# Altium project EEF AFE Base Board.PrjPcb
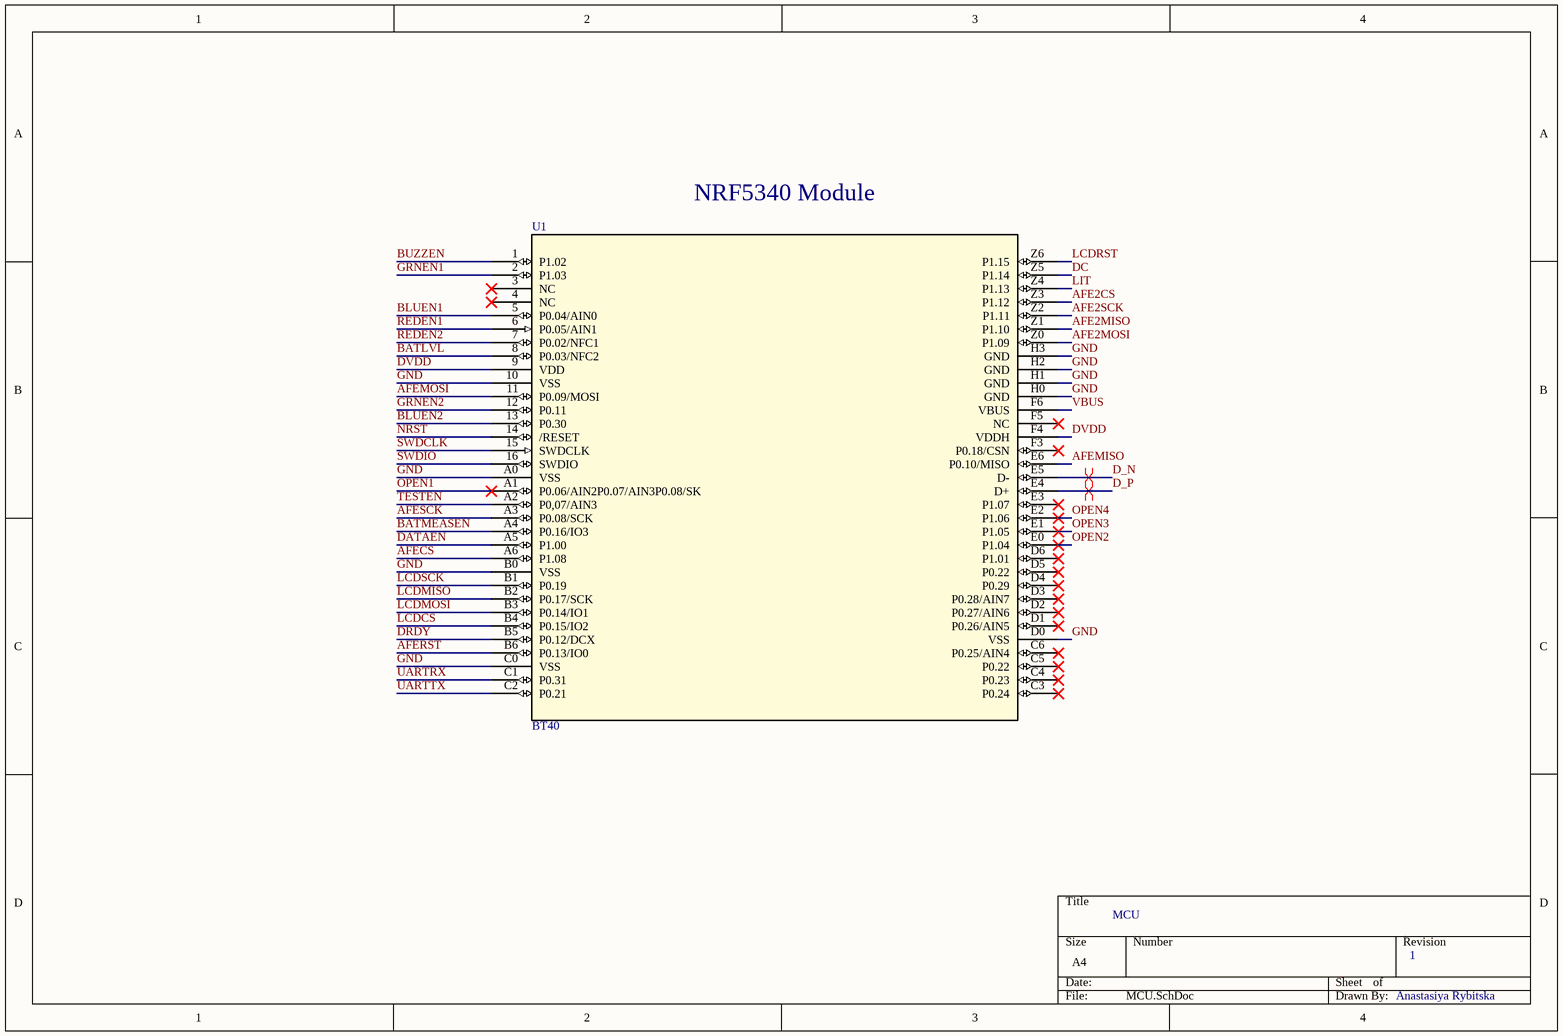
[diagram p0: MCU.SchDoc]
5 sheets, 114 parts. Net scope: global (net labels, ports and power ports of the same name join across sheets).
Board file: PCB1.PcbDoc
Sheets:
  MCU.SchDoc
  Power.SchDoc
  AFE.SchDoc
  EEG Inputs.SchDoc
  Peripherals.SchDoc

## Sheet MCU.SchDoc
size A4; SheetNumber: 1; SheetTotal: 5

### Parts
U1  BT40  [BT40E_FAN_FNL]

### Nets
DVDD: U1.9(VDD) U1.F4(VDDH)
GND: U1.10(VSS) U1.A0(VSS) U1.B0(VSS) U1.C0(VSS) U1.D0(VSS) U1.H0(GND) U1.H1(GND) U1.H2(GND) U1.H3(GND)
AFE2CS: U1.Z3(P1.12)
AFE2MISO: U1.Z1(P1.10)
AFE2MOSI: U1.Z0(P1.09)
AFE2SCK: U1.Z2(P1.11)
AFECS: U1.A6(P1.08)
AFEMISO: U1.E6(P0.10/MISO)
AFEMOSI: U1.11(P0.09/MOSI)
AFERST: U1.B6(P0.13/IO0)
AFESCK: U1.A3(P0.08/SCK)
BATLVL: U1.8(P0.03/NFC2)
BATMEASEN: U1.A4(P0.16/IO3)
BLUEN1: U1.5(P0.04/AIN0)
BLUEN2: U1.13(P0.30)
BUZZEN: U1.1(P1.02)
D_N: U1.E5(D-)
D_P: U1.E4(D+)
DATAEN: U1.A5(P1.00)
DC: U1.Z5(P1.14)
DRDY: U1.B5(P0.12/DCX)
GRNEN1: U1.2(P1.03)
GRNEN2: U1.12(P0.11)
LCDCS: U1.B4(P0.15/IO2)
LCDMISO: U1.B2(P0.17/SCK)
LCDMOSI: U1.B3(P0.14/IO1)
LCDRST: U1.Z6(P1.15)
LCDSCK: U1.B1(P0.19)
LIT: U1.Z4(P1.13)
NRST: U1.14(/RESET)
OPEN1: U1.A1(P0.06/AIN2P0.07/AIN3P0.08/SK)
OPEN2: U1.E0(P1.04)
OPEN3: U1.E1(P1.05)
OPEN4: U1.E2(P1.06)
REDEN1: U1.6(P0.05/AIN1)
REDEN2: U1.7(P0.02/NFC1)
SWDCLK: U1.15(SWDCLK)
SWDIO: U1.16(SWDIO)
TESTEN: U1.A2(P0,07/AIN3)
UARTRX: U1.C1(P0.31)
UARTTX: U1.C2(P0.21)
VBUS: U1.F6(VBUS)

Not connected (* = marked no-connect by the designer): U1 3(NC)* 4(NC)* C3(P0.24)* C4(P0.23)* C5(P0.22)* C6(P0.25/AIN4)* D1(P0.26/AIN5)* D2(P0.27/AIN6)* D3(P0.28/AIN7)* D4(P0.29)* D5(P0.22)* D6(P1.01)* E3(P1.07)* F3(P0.18/CSN)* F5(NC)*

### Layout directives
differential pair: D_N, D_P

### Notes on the sheet
- NRF5340 Module
- MCU
- 1
- Anastasiya Rybitska

### Library data of the parts
U1 = BT40: No Description Available; Mfr_Name: Fanstel; Type: RF; Copyright: Copyright (C) 2023 Ultra Librarian. All rights reserved.; Manufacturer_Part_Number: BT40; RefDes: RefDes

## Sheet Power.SchDoc
size A4; SheetNumber: 2; SheetTotal: 5
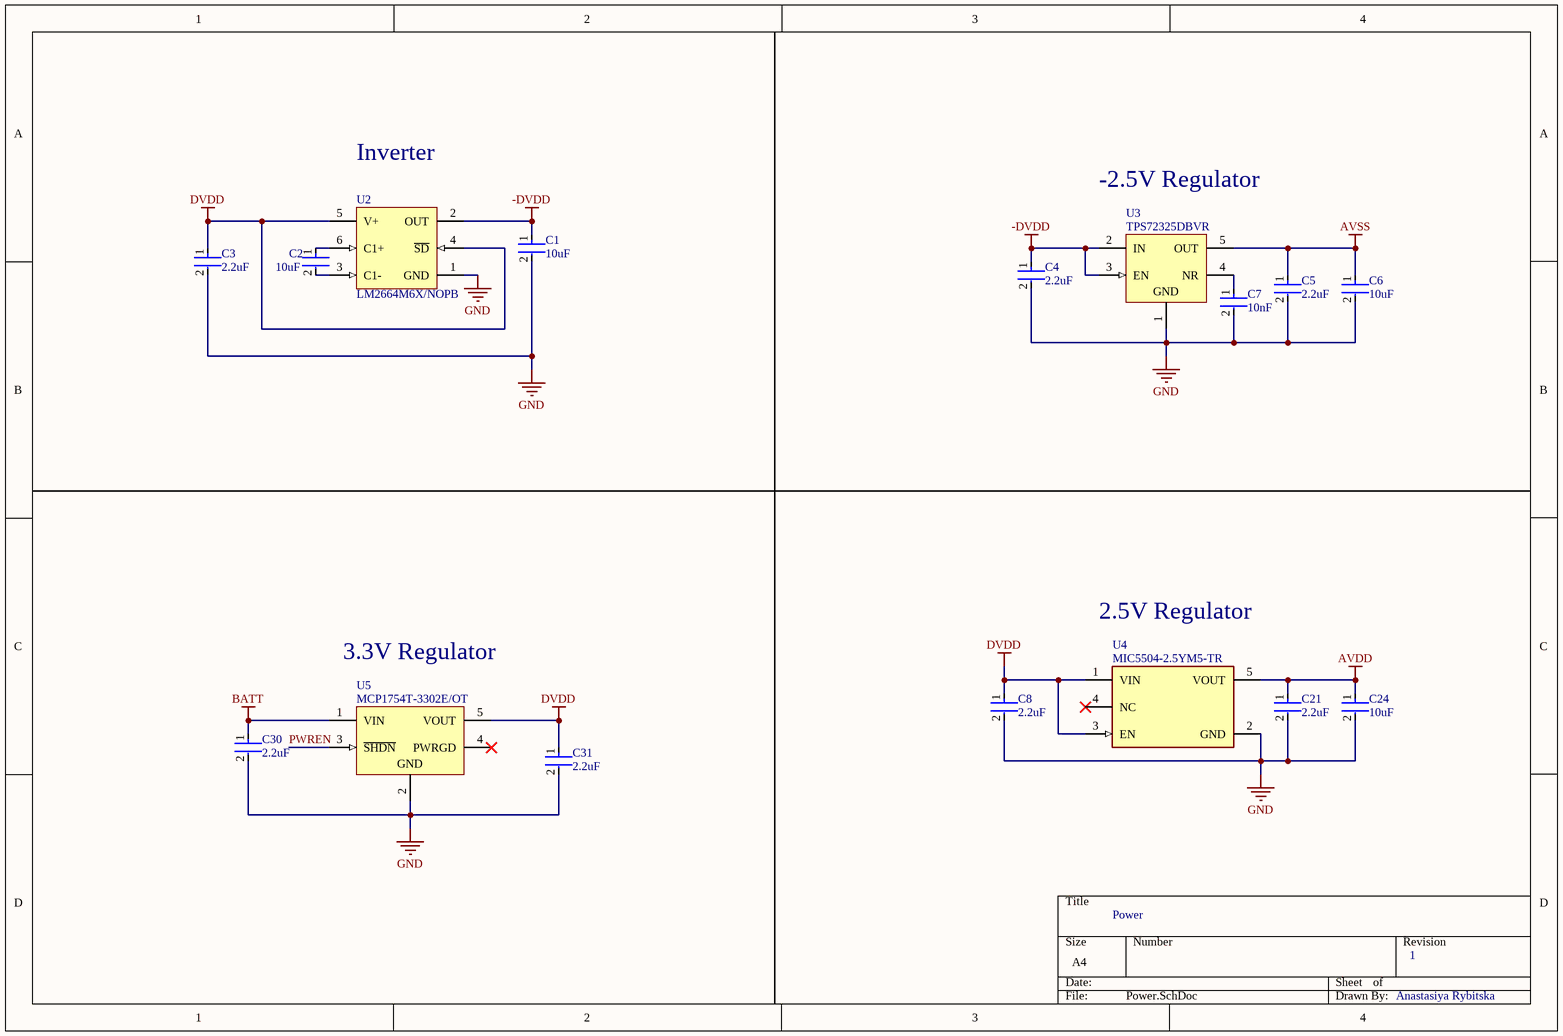
[diagram p1: Power.SchDoc]

### Parts
C1  Capacitance: 10uF  [FP-CL10-IPC_C]  (hidden comment: CL10A106MQ8NNNC)
C2  Capacitance: 10uF  [FP-CL10-IPC_C]  (hidden comment: CL10A106MQ8NNNC)
C3  Capacitance: 2.2uF  [FP-CL10-IPC_A]  (hidden comment: CL10A225KO8NNNC)
C4  Capacitance: 2.2uF  [FP-CL10-IPC_A]  (hidden comment: CL10A225KO8NNNC)
C5  Capacitance: 2.2uF  [FP-CL10-IPC_A]  (hidden comment: CL10A225KO8NNNC)
C6  Capacitance: 10uF  [FP-CL10-IPC_C]  (hidden comment: CL10A106MQ8NNNC)
C7  value 10nF  [FP-CC0603-DA-MFG]  (hidden comment: CC0603KRX7R9BB103)
C8  Capacitance: 2.2uF  [FP-CL10-IPC_A]  (hidden comment: CL10A225KO8NNNC)
C21  Capacitance: 2.2uF  [FP-CL10-IPC_A]  (hidden comment: CL10A225KO8NNNC)
C24  Capacitance: 10uF  [FP-CL10-IPC_C]  (hidden comment: CL10A106MQ8NNNC)
C30  Capacitance: 2.2uF  [FP-CL10-IPC_A]  (hidden comment: CL10A225KO8NNNC)
C31  Capacitance: 2.2uF  [FP-CL10-IPC_A]  (hidden comment: CL10A225KO8NNNC)
U2  LM2664M6X/NOPB  [DBV0006A_M]
U3  TPS72325DBVR  [DBV0005A_N]
U4  MIC5504-2.5YM5-TR  [FP-SOT23-5LD-PL-1-IPC_C]
U5  MCP1754T-3302E/OT  [MCHP-SOT-23-OT5_L]

### Nets
-DVDD: C1.1 C4.1 U2.2(OUT) U3.2(IN) U3.3(EN)
AVDD: C21.1 C24.1 U4.5(VOUT)
AVSS: C5.1 C6.1 U3.5(OUT)
BATT: C30.1 U5.1(VIN)
DVDD: C3.1 C8.1 C31.1 U2.4(~{SD}) U2.5(V+) U4.1(VIN) U4.3(EN) U5.5(VOUT)
GND: C1.2 C3.2 C4.2 C5.2 C6.2 C7.2 C8.2 C21.2 C24.2 C30.2 C31.2 U2.1(GND) U3.1(GND) U4.2(GND) U5.2(GND)
PWREN: U5.3(~{SHDN})
NetC2_1: C2.1 U2.6(C1+)
NetC2_2: C2.2 U2.3(C1-)
NetC7_1: C7.1 U3.4(NR)

Not connected (* = marked no-connect by the designer): U4 4(NC)*; U5 4(PWRGD)*

### Notes on the sheet
- Inverter
- -2.5V Regulator
- 2.5V Regulator
- 3.3V Regulator
- Power
- 1
- Anastasiya Rybitska

### Library data of the parts
C1 C2 C6 C24 = CMP-13271-001938-1: Cap Ceramic 10uF 6.3V X5R ±20% Pad SMD 0603 +85°C T/R; Contact Plating: Tin; Height: 0.8mm; Width: 0.031inch; Min Operating Temperature: -55°C; Dielectric: X5R; Voltage Rating: 6.3V; Case/Package: 0603; Package Quantity: 1; Radiation Hardening: No; Packaging: Tape and Reel; Max Operating Temperature: 85°C; Voltage: 6.3V; Thickness: 0.035inch; Mount: Surface Mount; Case Code (Imperial): 0603; Case Code (Metric): 1608; Depth: 0.8mm; Tolerance: 20%; Length: 1.6mm
C3-C5 C8 C21 C30 C31 = CMP-13271-000835-1: Cap Ceramic 2.2uF 16V X5R ±10% Pad SMD 0603 +85°C T/R; Case Code (Metric): 1608; Height: 0.8mm; Case/Package: 0603; Depth: 0.8mm; Voltage Rating: 16V; Case Code (Imperial): 0603; Length: 1.6mm; Packaging: Tape and Reel; Material: Ceramic; Lead Free: Lead Free; Max Operating Temperature: 85°C; Contact Plating: Tin; Thickness: 0.035inch; Radiation Hardening: No; Tolerance: 10%; Min Operating Temperature: -55°C; Voltage: 16V; Dielectric: X5R; Mount: Surface Mount; Package Quantity: 4000; Width: 0.031inch; Voltage Rating (DC): 16V
C7 = CMP-2100-03600-2: CAP CER 10000PF 50V X7R 0603; Manufacturer: YAGEO; Tolerance: 0.1; Material: Ceramic; Temperature Coefficient: 15%; Description: CC0603 10 nF X7R 10.00% 50 V; Capacitance: 10 nF; Mouser Description: Multilayer Ceramic Capacitor, CC Series, 0.01 - F, - 10%, X7R, 50 V, 0603 [1608 Metric]; Digikey Description: CAP CER 10000PF 50V X7R 0603; Height: 0.9mm; Category: Cap; Temperature Characteristic: X7R; Footprint Url: http://www.yageo.com/exep/pages/download/literatures/UPY-C_GEN_24.pdf; Lead Free: Yes; Voltage Rating: 50 V; Manufacturer Part Number: CC0603KRX7R9BB103; Temperature: -55°C to +125°C; Device Class L3: Ceramic Capacitors; ComponentLink2Description: Datasheet; Voltage: 50 V; Package: CC0603-DA; Octopart: https://octopart.com/cc0603krx7r9bb103-yageo-192938; Automotive: No; Temperature Range High: +125°C; Temperature Range Low: -55°C; RoHS: TRUE; Device Class L1: Passive Components; ComponentLink2URL: http://www.yageo.com/documents/recent/UPY-GPHC_X7R_6.3V-to-50V_18.pdf; Device Class L2: Capacitors
U2 = CMP-0065-00076-3: Switched Capacitor Voltage Converter, 6-pin SOT-23, Pb-Free; Manufacturer: Texas Instruments; CompType: Switch Caps; PackageTopMarking: S03A*XTT; PowerWise: N; PackageDescription: Molded SOT-23, .115 x .063 x .040in Body, 6 Lead, .0375in in Pitch; PinCount: 6; RoHS: Y; PackageReference: DBV0006A; ComponentLink1Description: Datasheet URL; Code_JEDEC: MO-178-AB; Code_IPC: SOT26A-6; ComponentLink1URL: http://www.ti.com/general/docs/lit/getliterature.tsp?genericPartNumber=LM2664&fileType=pdf
U3 = CMP-0394-00292-2: Single Output High PSRR LDO, 200 mA, Fixed -2.5 V Output, -10 to -2.7 V Input, 5-pin SOT-23 (DBV), -40 to 125 degC, Green (RoHS & no Sb/Br); Manufacturer: Texas Instruments; Iout(Max)(A): 0.2; Iq(Typ)(mA): 0.13; Accuracy(%): 2; Vdo(Typ)(mV): 280; SubFamily: Single Channel LDO; Vin(Max)(V): -2.7; PartNumber: TPS72325DBVR; PackageReference: DBV0005A; ComponentLink3Description: Package Specification; Fixed Output Options(V): -2.5; ComponentLink1URL: http://www.ti.com/; ComponentLink1Description: Manufacturer URL; Mounting Technology: Surface Mount; PackageDescription: 5-Pin Plastic Small Outline, Body 1.60 Ãƒâ€” 2.90 mm, Pitch 0.95 mm; ComponentLink2URL: http://www.ti.com/general/docs/lit/getliterature.tsp?genericPartNumber=TPS72325&fileType=pdf; PackageVersion: 4073253-4/K; ComponentLink3URL: http://www.ti.com/litv/pdf/mpds018i; Vout Adj(Min)(V): -2.5; ComponentLink2Description: Datasheet; Vout Adj(Max)(V): -2.5; Eco-Plan: Green (RoHS & no Sb/Br); DatasheetVersion: SLVS346B; Vin(Min)(V): -10; Code_JEDEC: MO-178
U4 = CMP-06324-000081-1: IC REG LINEAR 2.5V 300MA SOT23-5; Dropout Voltage: 160mV; Number of Regulators: 1; Min Current Limit: 400mA; Mount: Surface Mount; Output Current: 300mA; Min Operating Temperature: -40°C; Case/Package: SOT-23-5; Output Voltage: 2.5V; Packaging: Cut Tape; Max Operating Temperature: 125°C
U5 = CMP-0136-01150-1: 150 mA, 16 V, High Performance LDO, -40 to 125 degC, 5-pin SOT-23 (OT5), Tape and Reel; Manufacturer: Microchip; DatasheetVersion: Rev. A; ComponentLink3Description: Package Specification; ComponentLink4Description: Product URL; ComponentLink1URL: http://www.microchip.com; PackageReference: SOT-23-OT5; ComponentLink4URL: http://www.microchip.com/MCP1754; ComponentLink3URL: http://www.microchip.com/stellent/groups/techpub_sg/documents/packagingspec/en012702.pdf; ComponentLink1Description: Manufacturer URL; ComponentLink2URL: http://ww1.microchip.com/downloads/en/DeviceDoc/22276A.pdf; PackageDescription: 5-Lead Plastic Small Outline Transistor, 2.9 x 1.55 mm Body, 0.95 mm Pitch; PackageVersion: C04-091B; PartNumber: MCP1754T-3302E/OT; Mounting Technology: Surface Mount; ComponentLink2Description: Datasheet

## Sheet AFE.SchDoc
size A4; SheetNumber: 3; SheetTotal: 5
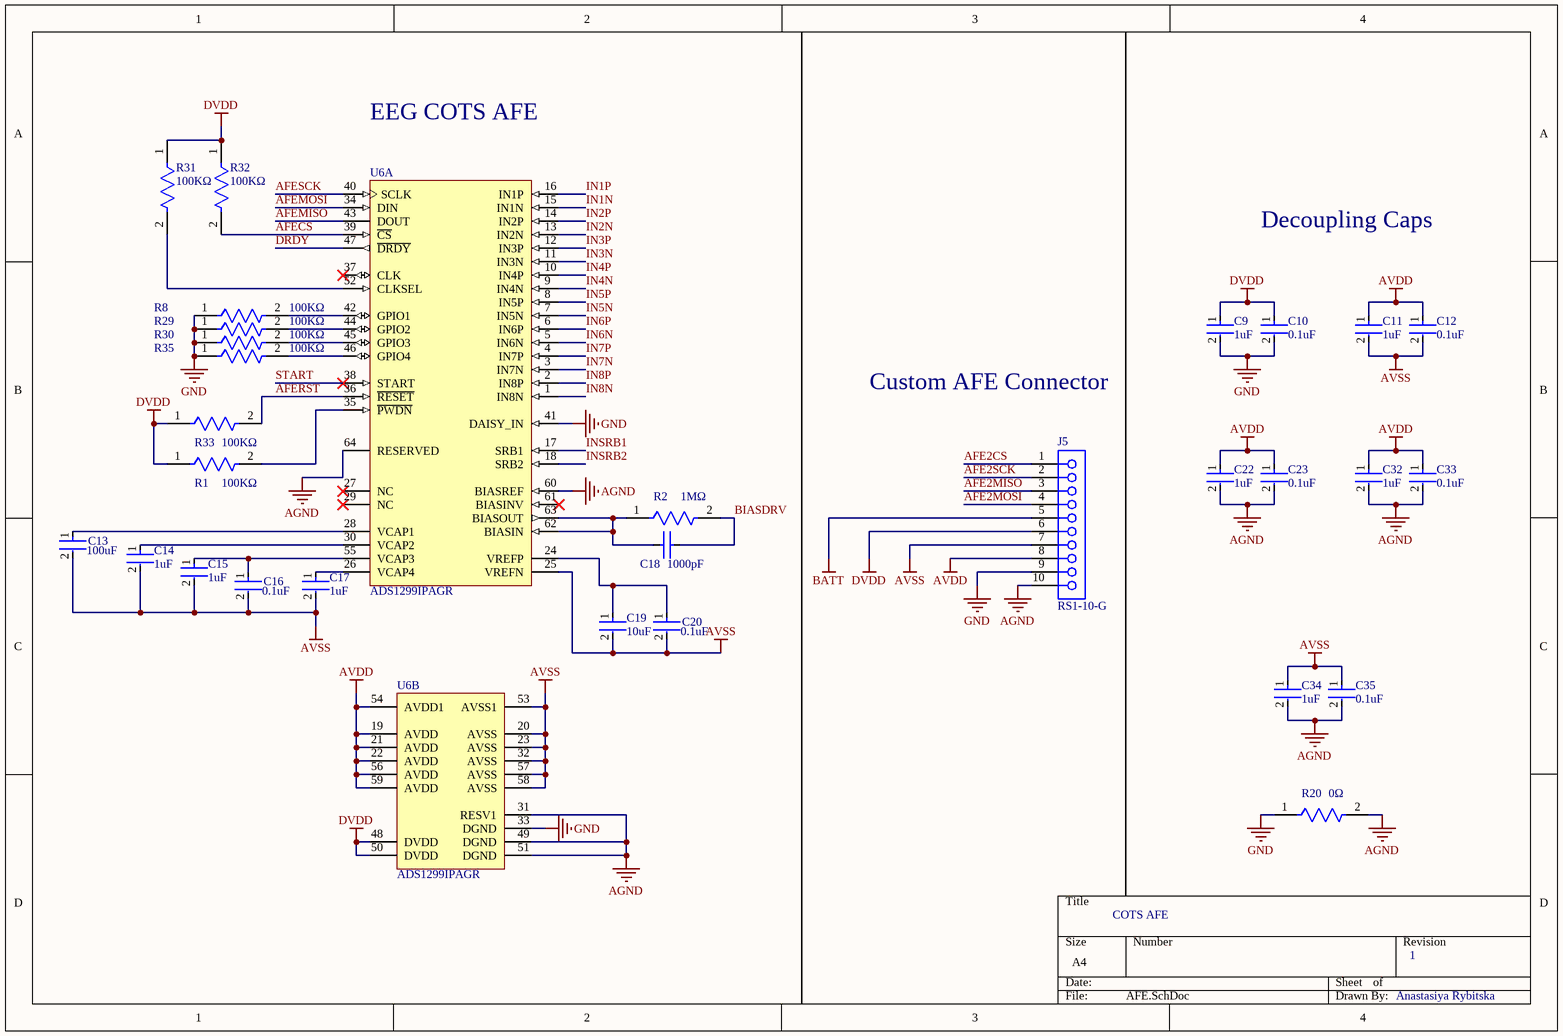
[diagram p2: AFE.SchDoc]

### Parts
C9  Capacitance: 1uF  [FP-CL10-IPC_C]  (hidden comment: CL10A105KA8NNNC)
C10  Capacitance: 0.1uF  [FP-0603-L_1_6_0_15-W_0_81-MFG]  (hidden comment: KGM15BR71H104JT)
C11  Capacitance: 1uF  [FP-CL10-IPC_C]  (hidden comment: CL10A105KA8NNNC)
C12  Capacitance: 0.1uF  [FP-0603-L_1_6_0_15-W_0_81-MFG]  (hidden comment: KGM15BR71H104JT)
C13  Capacitance: 100uF  [FP-GRM21B-0_2-e0_2_0_7-IPC_A]  (hidden comment: GRM21BR60E107ME15K)
C14  Capacitance: 1uF  [FP-CL10-IPC_C]  (hidden comment: CL10A105KA8NNNC)
C15  Capacitance: 1uF  [FP-CL10-IPC_C]  (hidden comment: CL10A105KA8NNNC)
C16  Capacitance: 0.1uF  [FP-0603-L_1_6_0_15-W_0_81-MFG]  (hidden comment: KGM15BR71H104JT)
C17  Capacitance: 1uF  [FP-CL10-IPC_C]  (hidden comment: CL10A105KA8NNNC)
C18  Capacitance: 1000pF  [CAP_0603_S_WAL]  (hidden comment: 0603N102F500CT)
C19  Capacitance: 10uF  [FP-CL10-IPC_C]  (hidden comment: CL10A106MQ8NNNC)
C20  Capacitance: 0.1uF  [FP-0603-L_1_6_0_15-W_0_81-MFG]  (hidden comment: KGM15BR71H104JT)
C22  Capacitance: 1uF  [FP-CL10-IPC_C]  (hidden comment: CL10A105KA8NNNC)
C23  Capacitance: 0.1uF  [FP-0603-L_1_6_0_15-W_0_81-MFG]  (hidden comment: KGM15BR71H104JT)
C32  Capacitance: 1uF  [FP-CL10-IPC_C]  (hidden comment: CL10A105KA8NNNC)
C33  Capacitance: 0.1uF  [FP-0603-L_1_6_0_15-W_0_81-MFG]  (hidden comment: KGM15BR71H104JT)
C34  Capacitance: 1uF  [FP-CL10-IPC_C]  (hidden comment: CL10A105KA8NNNC)
C35  Capacitance: 0.1uF  [FP-0603-L_1_6_0_15-W_0_81-MFG]  (hidden comment: KGM15BR71H104JT)
J5  RS1-10-G  [61301011821]
R1  Resistance: 100KΩ  [FP-RMCF0603-IPC_C]  (hidden comment: RMCF0603FT100K)
R2  Resistance: 1MΩ  [FP-ERJ3EK-IPC_C]  (hidden comment: ERJ-3EKF1004V)
R8  Resistance: 100KΩ  [FP-RMCF0603-IPC_C]  (hidden comment: RMCF0603FT100K)
R20  Resistance: 0Ω  [FP-RMCF0603-MFG]  (hidden comment: RMCF0603ZT0R00)
R29  Resistance: 100KΩ  [FP-RMCF0603-IPC_C]  (hidden comment: RMCF0603FT100K)
R30  Resistance: 100KΩ  [FP-RMCF0603-IPC_C]  (hidden comment: RMCF0603FT100K)
R31  Resistance: 100KΩ  [FP-RMCF0603-IPC_C]  (hidden comment: RMCF0603FT100K)
R32  Resistance: 100KΩ  [FP-RMCF0603-IPC_C]  (hidden comment: RMCF0603FT100K)
R33  Resistance: 100KΩ  [FP-RMCF0603-IPC_C]  (hidden comment: RMCF0603FT100K)
R35  Resistance: 100KΩ  [FP-RMCF0603-IPC_C]  (hidden comment: RMCF0603FT100K)
U6  ADS1299IPAGR  [PAG0064A_M]  (parts A,B of 2)

### Nets
AGND: C22.2 C23.2 C32.2 C33.2 C34.2 C35.2 J5.10 R20.2 U6.31(RESV1) U6.49(DGND) U6.51(DGND) U6.60(BIASREF) U6.64(RESERVED)
AVDD: C11.1 C12.1 C22.1 C23.1 C32.1 C33.1 J5.8 U6.19(AVDD) U6.21(AVDD) U6.22(AVDD) U6.54(AVDD1) U6.56(AVDD) U6.59(AVDD)
AVSS: C11.2 C12.2 C13.2 C14.2 C15.2 C16.2 C17.2 C19.2 C20.2 C34.1 C35.1 J5.7 U6.20(AVSS) U6.23(AVSS) U6.25(VREFN) U6.32(AVSS) U6.53(AVSS1) U6.57(AVSS) U6.58(AVSS)
BATT: J5.5
DVDD: C9.1 C10.1 J5.6 R1.1 R31.1 R32.1 R33.1 U6.48(DVDD) U6.50(DVDD)
GND: C9.2 C10.2 J5.9 R8.1 R20.1 R29.1 R30.1 R35.1 U6.33(DGND) U6.41(DAISY_IN)
AFE2CS: J5.1
AFE2MISO: J5.3
AFE2MOSI: J5.4
AFE2SCK: J5.2
AFECS: R32.2 U6.39(~{CS})
AFEMISO: U6.43(DOUT)
AFEMOSI: U6.34(DIN)
AFERST: R33.2 U6.36(~{RESET})
AFESCK: U6.40(SCLK)
BIASDRV: C18.2 R2.2
DRDY: U6.47(~{DRDY})
IN1N: U6.15(IN1N)
IN1P: U6.16(IN1P)
IN2N: U6.13(IN2N)
IN2P: U6.14(IN2P)
IN3N: U6.11(IN3N)
IN3P: U6.12(IN3P)
IN4N: U6.9(IN4N)
IN4P: U6.10(IN4P)
IN5N: U6.7(IN5N)
IN5P: U6.8(IN5P)
IN6N: U6.5(IN6N)
IN6P: U6.6(IN6P)
IN7N: U6.3(IN7N)
IN7P: U6.4(IN7P)
IN8N: U6.1(IN8N)
IN8P: U6.2(IN8P)
INSRB1: U6.17(SRB1)
INSRB2: U6.18(SRB2)
START: U6.38(START)
NetC13_1: C13.1 U6.28(VCAP1)
NetC14_1: C14.1 U6.30(VCAP2)
NetC15_1: C15.1 C16.1 U6.55(VCAP3)
NetC17_1: C17.1 U6.26(VCAP4)
NetC18_1: C18.1 R2.1 U6.62(BIASIN) U6.63(BIASOUT)
NetC19_1: C19.1 C20.1 U6.24(VREFP)
NetR1_2: R1.2 U6.35(~{PWDN})
NetR8_2: R8.2 U6.42(GPIO1)
NetR29_2: R29.2 U6.44(GPIO2)
NetR30_2: R30.2 U6.45(GPIO3)
NetR31_2: R31.2 U6.52(CLKSEL)
NetR35_2: R35.2 U6.46(GPIO4)

Not connected (* = marked no-connect by the designer): U6 27(NC)* 29(NC)* 37(CLK)* 61(BIASINV)*

### Notes on the sheet
- EEG COTS AFE
- Decoupling Caps
- Custom AFE Connector
- COTS AFE
- 1
- Anastasiya Rybitska

### Library data of the parts
C9 C11 C14 C15 C17 C22 C32 C34 = CMP-13271-004127-1: Cap Ceramic 1uF 25V X5R ±10% Pad SMD 0603 +85°C T/R; Height: 0.8mm; Depth: 0.8mm; Package Quantity: 1; Mount: Surface Mount; Contact Plating: Tin; Voltage Rating: 25V; Dielectric: X5R; Packaging: Tape and Reel; Material: Ceramic; Case Code (Metric): 1608; Length: 1.6mm; Voltage: 25V; Min Operating Temperature: -55°C; Width: 0.031inch; Tolerance: 10%; Case/Package: 0603; Radiation Hardening: No; Case Code (Imperial): 0603; Thickness: 0.035inch; Lead Free: Lead Free; Max Operating Temperature: 85°C; Voltage Rating (DC): 25V
C10 C12 C16 C20 C23 C33 C35 = CMP-07738-136560482-1: KGM15BR71H104JT Cap Cer 0.1UF 50V X7R 0603; Material: Ceramic; Tolerance: 5%; NexarPartId: 136560482; Height: 940µm; Voltage Rating: 50V; Case/Package: 0603; Max Operating Temperature: 125°C; Min Operating Temperature: -55°C
C13 = CMP-06035-026524-1: Chip Multilayer Ceramic Capacitors for General Purpose, 0805, 100uF, X5R, 15%, 20%, 2.5V; Tolerance: 20%; Width: 1.25mm; Dielectric: X5R; Voltage Rating (DC): 2.5V; Thickness: 1.25mm; Length: 2mm
C18 = 0603N102F500CT: No Description Available; Mfr_Name: Walsin; Type: DEV; Copyright: Copyright (C) 2023 Ultra Librarian. All rights reserved.; Manufacturer_Part_Number: 0603N102F500CT; RefDes: RefDes
C19 = CMP-13271-001938-1: as C1 on sheet Power; Contact Plating: Tin; Height: 0.8mm; Width: 0.031inch; Min Operating Temperature: -55°C; Dielectric: X5R; Voltage Rating: 6.3V; Case/Package: 0603; Package Quantity: 1; Radiation Hardening: No; Packaging: Tape and Reel; Max Operating Temperature: 85°C; Voltage: 6.3V; Thickness: 0.035inch; Mount: Surface Mount; Case Code (Imperial): 0603; Case Code (Metric): 1608; Depth: 0.8mm; Tolerance: 20%; Length: 1.6mm
J5 = CMP-1502-01332-2: NexarPartId: 18818160; Insulation: Insulated; Pitch: 2.54mm; Insulation Resistance: 1GΩ; Gender: Female; Contact Resistance: 20mΩ; Current Rating: 3A; Number of Positions: 10; Connector Type: Header, Socket; Operating Supply Voltage: 250V; Flammability Rating: UL94 V-0; RoHS: Compliant; Max Operating Temperature: 125°C; Length: 25.9mm; Contact Gender: Female; Contact Plating: Gold; REACH SVHC: Unknown; Number of Pins: 10; Number of Rows: 1; Termination: Through Hole; Orientation: Vertical; Contact Material: Copper; Color: Black; Mount: Through Hole; Width: 25.9mm; Height: 8.5mm; Number of Contacts: 10; Housing Material: PBT; Lead Free: Lead Free; Lead Pitch: 2.54mm; Min Operating Temperature: -40°C; Voltage Rating: 250V
R1 R8 R29-R33 R35 = CMP-2000-06989-2: 100kΩ ±1% 0.1W 0603 Thick Film Chip Resistor AEC-Q200 compliant; Working Voltage: 75V; Max Power Dissipation: 100mW; Temperature Coefficient: 100ppm/°C; Height: 0.022inch; Construction: Rectangular; Lead Free: Lead Free; Tolerance: 1%; Features: Automotive AEC-Q200; Packaging: Tape and Reel; Number of Terminations: 2; Mount: Surface Mount; Case Code (Imperial): 0603; Case/Package: 0603; Resistor Type: Thick Film; Radiation Hardening: No; Power Rating: 100mW; Max Operating Temperature: 155°C; Length: 1.55mm; Width: 0.031inch; Military Standard: Not; RoHS Compliant: Yes; Min Operating Temperature: -55°C; Series: RMCF; Depth: 0.8mm; Case Code (Metric): 1608; Contact Plating: Tin
R2 = CMP-1012-00849-3: RES SMD 1M OHM 1% 1/10W 0603; Voltage Rating: 75V; Temperature Coefficient: 100ppm/°C; Power Rating: 100mW; REACH SVHC: No SVHC; Radiation Hardening: No; Features: Automotive AEC-Q200; Case Code (Metric): 1608; Resistance Tolerance: 1%; Case/Package: 0603; Termination: SMD/SMT; Max Operating Temperature: 155°C; Tolerance: 1%; Size Code: 0603; Case Code (Imperial): 0603; Min Operating Temperature: -55°C; Number of Pins: 2; Mount: Surface Mount; Package Quantity: 1; Military Standard: Not; Voltage Rating (DC): 75V; Depth: 0.8mm; Packaging: Tape and Reel; Width: 0.8mm; Number of Terminations: 2; Length: 1.6mm; Height: 0.022inch; RoHS Compliant: Yes; Resistor Type: Thick Film; Contact Plating: Tin; Lead Free: Lead Free; Series: ERJ; Construction: Rectangular; Max Power Dissipation: 100mW
R20 = CMP-26527-000011-1: RES 0 OHM JUMPER 1/10W 0603; Manufacturer: Stackpole; Power Rating: 0.1W; Voltage Rating: 75V; Automotive Grade: Grade 0; Value: 0mΩ; Series: RMCF; Manufacturer Part Number: RMCF0603ZT0R00; Device Class L1: Passive Components; Device Class L3: Chip SMD Resistors; Octopart: https://octopart.com/rmcf0603zt0r00-stackpole+electronics-19213618; Temperature: -55°C to +155°C; Lead Free: Yes; ComponentLink2URL: https://www.seielect.com/catalog/sei-rmcf_rmcp.pdf; Height: 0.55mm; Composition: Thick Film; Package: RMCF0603; Automotive: Yes; Temperature Range High: +155°C; Ipc Land Pattern Name: RESC15580X45; Digikey Description: RES 0 OHM JUMPER 1/10W 0603; RoHS: TRUE; ComponentLink2Description: Datasheet; Temperature Range Low: -55°C; Category: Res; Device Class L2: Resistors
U6 = CMP-0841-00001-2: Low-Noise, 8-Channel, 24-Bit Analog Front-End for Biopotential Measurement, 16 KSPS, -40 to 85 degC, 64-Pin PQFP (PAG-64), RoHS, Tape and Reel; Manufacturer: Texas Instruments; Architecture: Delta-Sigma; Interface: Serial SPI; # Input Channels: 8; Sample Rate (max) (KSPS): 16; Packing: PAG0064A; Reference Mode: Int, Ext; Resolution (Bits): 24; PackageReference: PAG-64; ComponentLink2Description: Datasheet; Operating Temperature Range (C): -40 to 85; ComponentLink1Description: Manufacturer URL; Mounting Technology: Surface Mount; ComponentLink3Description: Package Specification; PartNumber: ADS1299IPAGR; PackageDescription: 64-Pin Plastic Quad Flatpack, Body 10 x 10 mm, Pitch 0.5 mm; ComponentLink2URL: http://www.ti.com/lit/ds/symlink/ads1299.pdf; PackageVersion: 4040282/C; ComponentLink1URL: http://www.ti.com/; ComponentLink3URL: http://www.ti.com/lit/ml/mtqf006a/mtqf006a.pdf; RoHS: TRUE; DatasheetVersion: SBAS499A

## Sheet EEG Inputs.SchDoc
size A4; SheetNumber: 4; SheetTotal: 5
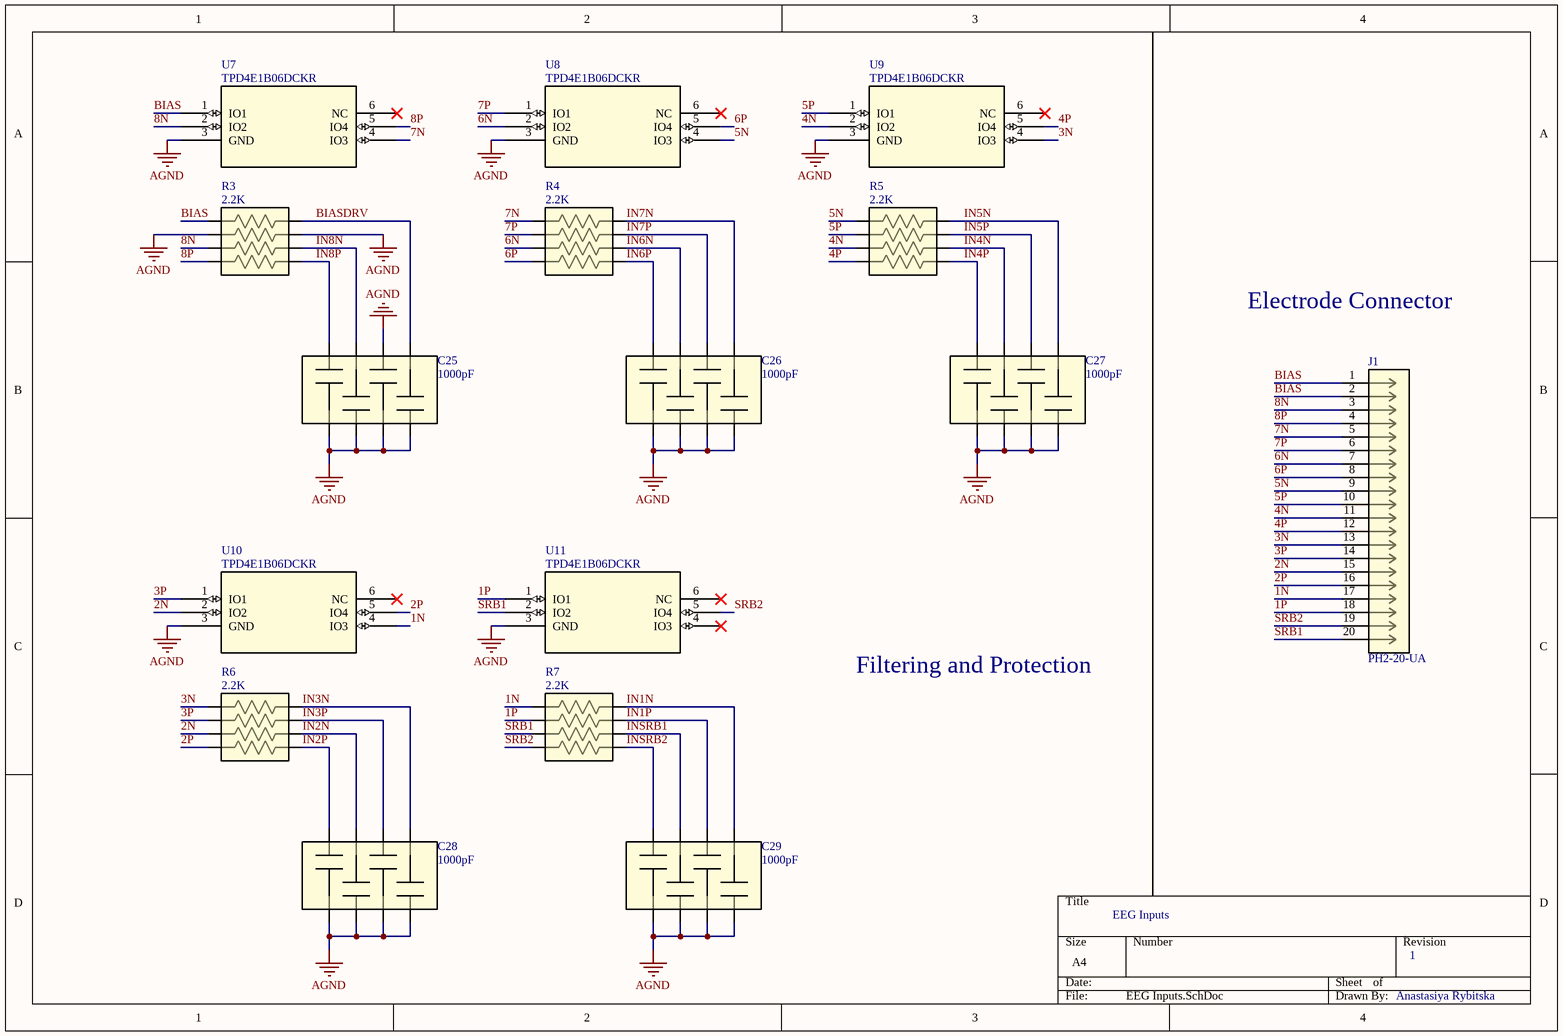
[diagram p3: EEG Inputs.SchDoc]

### Parts
C25  Capacitance: 1000pF  [CAP_CA0612_3P2X1P6_YAG]  (hidden comment: CA0612KRX7R9BB102)
C26  Capacitance: 1000pF  [CAP_CA0612_3P2X1P6_YAG]  (hidden comment: CA0612KRX7R9BB102)
C27  Capacitance: 1000pF  [CAP_CA0612_3P2X1P6_YAG]  (hidden comment: CA0612KRX7R9BB102)
C28  Capacitance: 1000pF  [CAP_CA0612_3P2X1P6_YAG]  (hidden comment: CA0612KRX7R9BB102)
C29  Capacitance: 1000pF  [CAP_CA0612_3P2X1P6_YAG]  (hidden comment: CA0612KRX7R9BB102)
J1  PH2-20-UA  [CONN_PH2-20-UA_ADM]
R3  Resistance: 2.2K  [CAY16_BRN]  (hidden comment: CAY16-2201F4LF)
R4  Resistance: 2.2K  [CAY16_BRN]  (hidden comment: CAY16-2201F4LF)
R5  Resistance: 2.2K  [CAY16_BRN]  (hidden comment: CAY16-2201F4LF)
R6  Resistance: 2.2K  [CAY16_BRN]  (hidden comment: CAY16-2201F4LF)
R7  Resistance: 2.2K  [CAY16_BRN]  (hidden comment: CAY16-2201F4LF)
U7  TPD4E1B06DCKR  [DCK6_TEX]
U8  TPD4E1B06DCKR  [DCK6_TEX]
U9  TPD4E1B06DCKR  [DCK6_TEX]
U10  TPD4E1B06DCKR  [DCK6_TEX]
U11  TPD4E1B06DCKR  [DCK6_TEX]

### Nets
AGND: C25.1 C25.2 C25.3 C25.4 C25.6 C26.1 C26.2 C26.3 C26.4 C27.1 C27.2 C27.3 C27.4 C28.1 C28.2 C28.3 C28.4 C29.1 C29.2 C29.3 C29.4 R3.2 R3.7 U7.3(GND) U8.3(GND) U9.3(GND) U10.3(GND) U11.3(GND)
1N: J1.17 R7.1 U10.4(IO3)
1P: J1.18 R7.2 U11.1(IO1)
2N: J1.15 R6.3 U10.2(IO2)
2P: J1.16 R6.4 U10.5(IO4)
3N: J1.13 R6.1 U9.4(IO3)
3P: J1.14 R6.2 U10.1(IO1)
4N: J1.11 R5.3 U9.2(IO2)
4P: J1.12 R5.4 U9.5(IO4)
5N: J1.9 R5.1 U8.4(IO3)
5P: J1.10 R5.2 U9.1(IO1)
6N: J1.7 R4.3 U8.2(IO2)
6P: J1.8 R4.4 U8.5(IO4)
7N: J1.5 R4.1 U7.4(IO3)
7P: J1.6 R4.2 U8.1(IO1)
8N: J1.3 R3.3 U7.2(IO2)
8P: J1.4 R3.4 U7.5(IO4)
BIAS: J1.1 J1.2 R3.1 U7.1(IO1)
BIASDRV: C25.5 R3.8
IN1N: C29.5 R7.8
IN1P: C29.6 R7.7
IN2N: C28.7 R6.6
IN2P: C28.8 R6.5
IN3N: C28.5 R6.8
IN3P: C28.6 R6.7
IN4N: C27.7 R5.6
IN4P: C27.8 R5.5
IN5N: C27.5 R5.8
IN5P: C27.6 R5.7
IN6N: C26.7 R4.6
IN6P: C26.8 R4.5
IN7N: C26.5 R4.8
IN7P: C26.6 R4.7
IN8N: C25.7 R3.6
IN8P: C25.8 R3.5
INSRB1: C29.7 R7.6
INSRB2: C29.8 R7.5
SRB1: J1.20 R7.3 U11.2(IO2)
SRB2: J1.19 R7.4 U11.5(IO4)

Not connected (* = marked no-connect by the designer): U7 6(NC)*; U8 6(NC)*; U9 6(NC)*; U10 6(NC)*; U11 4(IO3)* 6(NC)*

### Notes on the sheet
- Electrode Connector
- Filtering and Protection
- EEG Inputs
- 1
- Anastasiya Rybitska

### Library data of the parts
J1 = PH2-20-UA: No Description Available; Mfr_Name: ADAM TECHNOLOGIES INC; Type: DEV; Copyright: Copyright (C) 2024 Ultra Librarian. All rights reserved.; Manufacturer_Part_Number: PH2-20-UA; RefDes: RefDes
R3-R7 = CAY16-2201F4LF: No Description Available; Mfr_Name: Bourns Electronics; Type: DEV; Copyright: Copyright (C) 2023 Ultra Librarian. All rights reserved.; Manufacturer_Part_Number: CAY16-2201F4LF; RefDes: RefDes
U7-U11 = TPD4E1B06DCKR: No Description Available; Mfr_Name: Texas Instruments; Copyright: Copyright (C) 2023 Ultra Librarian. All rights reserved.; Manufacturer_Part_Number: TPD4E1B06DCKR; RefDes: RefDes; Type: DEV

## Sheet Peripherals.SchDoc
size A4; SheetNumber: 5; SheetTotal: 5
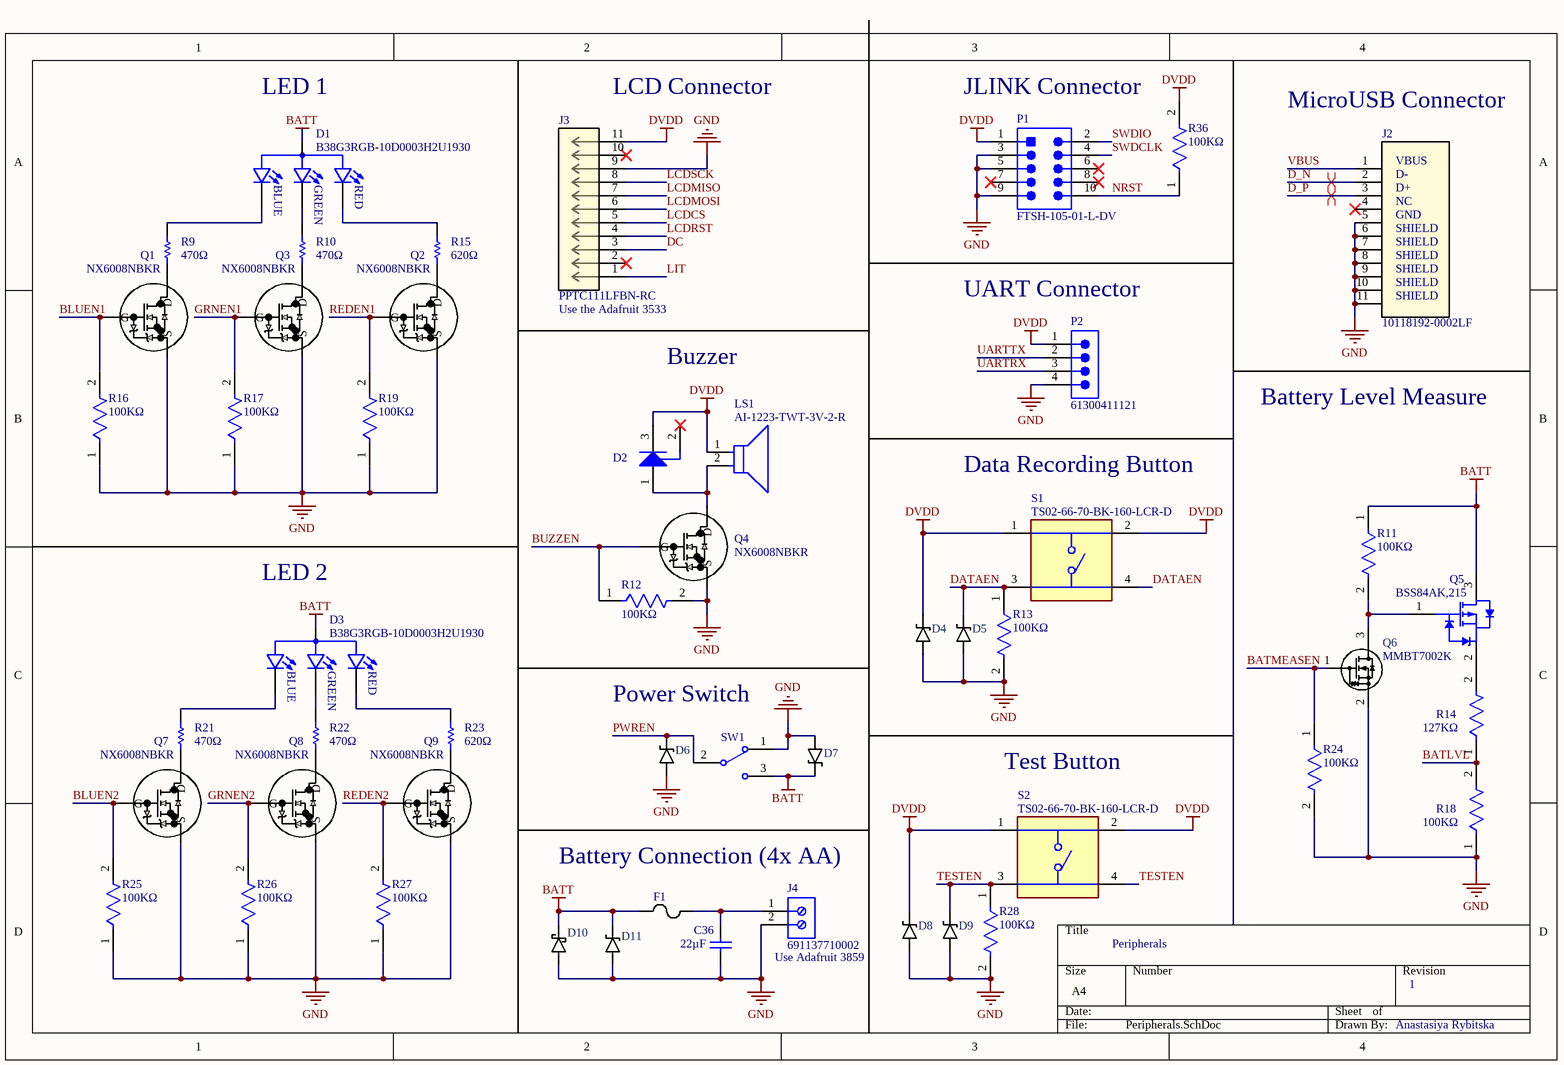
[diagram p4: Peripherals.SchDoc]

### Parts
C36  Capacitance: 22µF  [KEMT-1206-2_M]  (hidden comment: TCJA226M016R0300E)
D1  B38G3RGB-10D0003H2U1930  [LED_B38G3RGB-10D0003H2U1930]
D2  BAS16LT1G  [ONSC-SOT-23-3-318-08_V]  (value not drawn)
D3  B38G3RGB-10D0003H2U1930  [LED_B38G3RGB-10D0003H2U1930]
D4  ESD5Z3V3  [SOD-523]  (value not drawn)
D5  ESD5Z3V3  [SOD-523]  (value not drawn)
D6  ESD5Z3V3  [SOD-523]  (value not drawn)
D7  ESD5Z3V3  [SOD-523]  (value not drawn)
D8  ESD5Z3V3  [SOD-523]  (value not drawn)
D9  ESD5Z3V3  [SOD-523]  (value not drawn)
D10  SK16  [DO-214AC_SMA]  (value not drawn)
D11  ESD5Z3V3  [SOD-523]  (value not drawn)
F1  MFU0603FF02000P500  [FUS_VISHAY_MFU0603_VIS]  (value not drawn)
J2  10118192-0002LF  [CONN_10118192-0002LF_AMP]
J3  PPTC111LFBN-RC  [CONN11_PPPN111_SUL]
J4  691137710002  [691137710002]
LS1  AI-1223-TWT-3V-2-R  [FP-AI-1223-TWT-3V-2-R-MFG]
P1  FTSH-105-01-L-DV  [SMTC-FTSH-105-01-L-DV_V]
P2  61300411121  [61300411121]
Q1  NX6008NBKR  [NX6008NBKR_NEX]
Q2  NX6008NBKR  [NX6008NBKR_NEX]
Q3  NX6008NBKR  [NX6008NBKR_NEX]
Q4  NX6008NBKR  [NX6008NBKR_NEX]
Q5  BSS84AK,215  [NXP-SOT23_N]
Q6  MMBT7002K  [SOT-23]
Q7  NX6008NBKR  [NX6008NBKR_NEX]
Q8  NX6008NBKR  [NX6008NBKR_NEX]
Q9  NX6008NBKR  [NX6008NBKR_NEX]
R9  Resistance: 470Ω  [RESC1608X55X25NL10T15]  (hidden comment: RC0603FR-13470RL)
R10  Resistance: 470Ω  [RESC1608X55X25NL10T15]  (hidden comment: RC0603FR-13470RL)
R11  Resistance: 100KΩ  [FP-RMCF0603-IPC_C]  (hidden comment: RMCF0603FT100K)
R12  Resistance: 100KΩ  [FP-RMCF0603-IPC_C]  (hidden comment: RMCF0603FT100K)
R13  Resistance: 100KΩ  [FP-RMCF0603-IPC_C]  (hidden comment: RMCF0603FT100K)
R14  Resistance: 127KΩ  [FP-RT0603-MFG]  (hidden comment: RT0603FRE07127KL)
R15  Resistance: 620Ω  [RESC1608X55X25LL10T15]  (hidden comment: RC0603JR-07620RL)
R16  Resistance: 100KΩ  [FP-RMCF0603-IPC_C]  (hidden comment: RMCF0603FT100K)
R17  Resistance: 100KΩ  [FP-RMCF0603-IPC_C]  (hidden comment: RMCF0603FT100K)
R18  Resistance: 100KΩ  [FP-RMCF0603-IPC_C]  (hidden comment: RMCF0603FT100K)
R19  Resistance: 100KΩ  [FP-RMCF0603-IPC_C]  (hidden comment: RMCF0603FT100K)
R21  Resistance: 470Ω  [RESC1608X55X25NL10T15]  (hidden comment: RC0603FR-13470RL)
R22  Resistance: 470Ω  [RESC1608X55X25NL10T15]  (hidden comment: RC0603FR-13470RL)
R23  Resistance: 620Ω  [RESC1608X55X25LL10T15]  (hidden comment: RC0603JR-07620RL)
R24  Resistance: 100KΩ  [FP-RMCF0603-IPC_C]  (hidden comment: RMCF0603FT100K)
R25  Resistance: 100KΩ  [FP-RMCF0603-IPC_C]  (hidden comment: RMCF0603FT100K)
R26  Resistance: 100KΩ  [FP-RMCF0603-IPC_C]  (hidden comment: RMCF0603FT100K)
R27  Resistance: 100KΩ  [FP-RMCF0603-IPC_C]  (hidden comment: RMCF0603FT100K)
R28  Resistance: 100KΩ  [FP-RMCF0603-IPC_C]  (hidden comment: RMCF0603FT100K)
R36  Resistance: 100KΩ  [FP-RMCF0603-IPC_C]  (hidden comment: RMCF0603FT100K)
S1  TS02-66-70-BK-160-LCR-D  [SW_TS02-66-70-BK-160-LCR-D]
S2  TS02-66-70-BK-160-LCR-D  [SW_TS02-66-70-BK-160-LCR-D]
SW1  EG1218  [ESWI-EG1218_V]  (value not drawn)

### Nets
BATT: D1.3(A) D3.3(A) D7.K D10.K D11.K F1.1 Q5.3(D) R11.1 SW1.3
DVDD: D2.3(K) D4.K D8.K J3.11 LS1.1(C) P1.1 P2.1 R36.2 S1.1 S1.2 S2.1 S2.2
GND: C36.1 D4.A D5.A D6.A D7.A D8.A D9.A D10.A D11.A J2.5 J2.6 J2.7 J2.8 J2.9 J2.10 J2.11 J3.9 J4.2 P1.3 P1.5 P1.9 P2.4 Q1.2(S) Q2.2(S) Q3.2(S) Q4.2(S) Q6.2(S) Q7.2(S) Q8.2(S) Q9.2(S) R12.2 R13.2 R16.1 R17.1 R18.1 R19.1 R24.2 R25.1 R26.1 R27.1 R28.2 SW1.1
BATLVL: R14.1 R18.2
BATMEASEN: Q6.1(G) R24.1
BLUEN1: Q1.1(G) R16.2
BLUEN2: Q7.1(G) R25.2
BUZZEN: Q4.1(G) R12.1
D_N: J2.2
D_P: J2.3
DATAEN: D5.K R13.1 S1.3 S1.4
DC: J3.3
GRNEN1: Q3.1(G) R17.2
GRNEN2: Q8.1(G) R26.2
LCDCS: J3.5
LCDMISO: J3.7
LCDMOSI: J3.6
LCDRST: J3.4
LCDSCK: J3.8
LIT: J3.1
NRST: P1.10 R36.1
PWREN: D6.K SW1.2(COM)
REDEN1: Q2.1(G) R19.2
REDEN2: Q9.1(G) R27.2
SWDCLK: P1.4
SWDIO: P1.2
TESTEN: D9.K R28.1 S2.3 S2.4
UARTRX: P2.3
UARTTX: P2.2
VBUS: J2.1
NetC36_2: C36.2 F1.2 J4.1
NetD1_1: D1.1(G_C) R10.2
NetD1_2: D1.2(B_C) R9.2
NetD1_4: D1.4(R_C) R15.2
NetD2_1: D2.1(A) LS1.2(A) Q4.3(D)
NetD3_1: D3.1(G_C) R22.2
NetD3_2: D3.2(B_C) R21.2
NetD3_4: D3.4(R_C) R23.2
NetQ1_3: Q1.3(D) R9.1
NetQ2_3: Q2.3(D) R15.1
NetQ3_3: Q3.3(D) R10.1
NetQ5_1: Q5.1(G) Q6.3(D) R11.2
NetQ5_2: Q5.2(S) R14.2
NetQ7_3: Q7.3(D) R21.1
NetQ8_3: Q8.3(D) R22.1
NetQ9_3: Q9.3(D) R23.1

Not connected (* = marked no-connect by the designer): D2 2(NC)*; J2 4*; J3 2* 10*; P1 6* 7* 8*

### Layout directives
differential pair: D_N, D_P

### Notes on the sheet
- LED 1
- (near J3) LCD Connector
- JLINK Connector
- MicroUSB Connector
- (near J3) Use the Adafruit 3533
- (near P2) UART Connector
- Buzzer
- Battery Level Measure
- Data Recording Button
- LED 2
- Power Switch
- Test Button
- Battery Connection (4x AA)
- Peripherals
- Use Adafruit 3859
- 1
- Anastasiya Rybitska
- (in symbol 10118192-0002LF) VBUS; D-; D+; NC; GND; SHIELD
- (in symbol B38G3RGB-10D0003H2U1930) BLUE; GREEN; RED

### Library data of the parts
C36 = CMP-1037-04202-2: CAP TANT POLY 22UF 16V 1206; Manufacturer: Kemet; Voltage Rating: 50V; Product Range: KEMET-CSeries; SVHC: ToBeAdvised; Capacitance Tolerance: ±10%; Dielectric Characteristic: X7R; Capacitor Case Style: 1206[3216Metric]; Package Reference: 1206-2; Package Description: 2-Leads SMD, Body 3.2 x 1.6 mm; Packaging: Tape&Reel; Operating Temperature Max: 125degC; Datasheet URL: https://datasheet.ciiva.com/6125/1725438-6125494.pdf; Manufacturer URL: http://www.kemet.com/; Operating Temperature Min: -55degC; Datasheet Version: Jul-13
D1 D3 = B38G3RGB-10D0003H2U1930: Red, Green, Blue (RGB) - LED Indication - Discrete 2V Red, 3V Green, 3V Blue 0606 (1616 Metric); MF: Harvatek Corporation; Price: None; Purchase-URL: https://pricing.snapeda.com/search/part/B38G3RGB-10D0003H2U1930/?ref=eda; SnapEDA_Link: https://www.snapeda.com/parts/B38G3RGB-10D0003H2U1930/Harvatek/view-part/?ref=snap; Availability: In Stock; Value: *; MP: B38G3RGB-10D0003H2U1930; Package: None; Check_prices: https://www.snapeda.com/parts/B38G3RGB-10D0003H2U1930/Harvatek/view-part/?ref=eda
D2 = CMP-1054-00156-1: Switching Diode, 3-Pin SOT-23, Pb-Free, Tape and Reel; Manufacturer: On Semiconductor; trr Max (ns): 6; IF Max (A): 0.2; Configuration: Single; PackageVersion: Rev. AP, 11/2009; ComponentLink1Description: Manufacturer URL; ComponentLink2Description: Datasheet; Mounting Technology: Surface Mount; PartNumber: BAS16LT1G; ComponentLink3URL: http://www.onsemi.cn/pub_link/Collateral/318-08.PDF; ComponentLink3Description: Package Specification; PackageReference: SOT-23-3-318-08; DatasheetVersion: Rev. 10; ComponentLink1URL: http://www.onsemi.com/; PackageDescription: 3-Pin Small Outline Transistor, Body 2.92 x 1.3 mm, Pitch 0.95 mm; ComponentLink2URL: http://www.onsemi.com/pub_link/Collateral/BAS16LT1-D.PDF; Packing: Tape and Reel; RoHS: TRUE
D4-D9 D11 = ESD5Z3V3: ki_keywords: Zener TVS unidirectional Diode; ki_description: Zener Diode, TVS-unidirectional Diode; Datasheet: https://diotec.com/de/produktliste/Z.html
D10 = SK16: ki_keywords: Schottky; ki_description: Schottky Diode; Datasheet: https://diotec.com/de/produktliste/SBD.html
F1 = MFU0603FF02000P500: No Description Available; Mfr_Name: Vishay; Type: DEV; Copyright: Copyright (C) 2024 Ultra Librarian. All rights reserved.; Manufacturer_Part_Number: MFU0603FF02000P500; RefDes: RefDes
J2 = 10118192-0002LF: No Description Available; Mfr_Name: Amphenol ICC; Copyright: Copyright (C) 2024 Ultra Librarian. All rights reserved.; Manufacturer_Part_Number: 10118192-0002LF; RefDes: RefDes; Type: DEV
J3 = PPTC111LFBN-RC: No Description Available; Mfr_Name: Sullins; Type: DEV; Copyright: Copyright (C) 2023 Ultra Librarian. All rights reserved.; Manufacturer_Part_Number: PPTC111LFBN-RC; RefDes: RefDes
J4 = CMP-1502-03324-2: NexarPartId: 78871135; Voltage Rating: 300V; Number of Contacts: 2; Current Rating: 16A; Lead Pitch: 5mm; Height: 11.6mm; Packaging: Box; RoHS: Non-Compliant; Contact Material: Nickel, Tin; Max Operating Temperature: 120°C; Number of Pins: 2; Min Operating Temperature: -30°C; Number of Rows: 1
LS1 = CMP-103888-000003-1: BUZZER MAGNETIC 3V 12MM TH; Min Supply Voltage (DC): 2V; Operating Supply Current: 30mA; Max Supply Voltage (DC): 4V; Input Type: DC; Frequency: 2.3kHz; Series: AI; Nominal Supply Voltage (DC): 3V; Packaging: Tray; Max Operating Temperature: 70°C; Height: 7.5mm; Termination: PC Pins; Max Supply Current: 30mA; Mount: Through Hole; Diameter: 12mm; Voltage Rating: 3V; Sensing Method: Magnetic; Min Operating Temperature: -20°C; Contact Plating: Tin
P1 = CMP-2000-05354-1: CONN HEADER SMD 10POS 1.27MM (get from Garmin, or order cheaper); Manufacturer: Samtec; Connector Type: Header,Unshrouded; Pitch: 0.050"(1.27mm); Mating Products: FLE-105-01-G-DV-TR-ND-CONNSKT1.27MM10POSDUALSMDCLP-105-02-G-D-P-TR-ND-CONNRCPT10POSDUAL.05"SMDSFMC-105-L2-S-D-TR-ND-CONN.05"SURFACE10POSSMTSFMH-105-02-L-D-TR-ND-CONNRECEPT10POS.50"SMTFLE-105-01-G-DV-A-ND-CONNSKT1.27MM10POSDUALSMDCLP-105-02-G-D-BE-ND-CONNRCPT10POSDUAL.05"SMDFLE-105-01-G-DV-A-P-ND-CONNSKT1.27MM10POSDUALSMDSAM1153-05-ND-CONNRCPT10POSDUAL.05"SMDSAM1155-05-ND-CONNRCPT10POSDUAL.05"SMDSAM1154-05-ND-CONNRCPT10POSDUAL.05"SMDSFMH-105-02-L-D-LC-ND-CONNRECEPT10POS.50"SMTSAM1226-05-ND-CONNRCPT.05"10POSDUALSMD; Catalog Drawings: FTSHSeriesFTSHSeriesSMTSide; Other Names: SAM1161-05; EDA / CAD Models: DownloadfromAcceleratedDesigns; Number of Positions Loaded: All; Number of Positions: 10; Featured Product: Board-To-BoardInterconnectSystems; Online Catalog: FTSHSeries; Product Training Modules: Board-to-BoardConnectors; Category: Connectors,Interconnects; Number of Rows: 2; Contact Finish: Gold; Termination: Solder; Mounting Type: SurfaceMount; Series: FTSH; Contact Mating Length: 0.120"(3.05mm); Row Spacing: 0.050"(1.27mm); Datasheet URL: https://datasheet.ciiva.com/30493/0900766b80adfe36-30493006.pdf; Contact Finish Thickness: 10µin(0.25µm); Features: -; Standard Package: 1; Packaging: Bulk; Datasheet Version: Feb-08; Manufacturer URL: http://www.samtec.com/; Fastening Type: -; Family: RectangularConnectors-Headers,MalePins; Contact Type: MalePin; Color: Black
P2 = CMP-1502-01064-2: NexarPartId: 32855522; Pitch: 2.54mm; Number of Contacts: 4; Contact Resistance: 20mΩ; Gender: Male; Current Rating: 3A; Connector Type: Male Pin; Voltage Rating: 250V; Lead Free: Lead Free; Contact Plating: Gold; Max Operating Temperature: 105°C; Packaging: Bulk; Height: 8.89mm; Orientation: Vertical; Contact Mating Length: 5.9944mm; Contact Material: Copper; Lead Pitch: 2.54mm; Min Operating Temperature: -40°C; Termination: Solder; Color: Black; Number of Rows: 1; REACH SVHC: Unknown; RoHS: Compliant; Mount: Through Hole; Number of Positions: 4; Number of Pins: 4; Operating Supply Voltage: 250V
Q1-Q4 Q7-Q9 = NX6008NBKR: No Description Available; Mfr_Name: Nexperia; Type: DEV; Copyright: Copyright (C) 2023 Ultra Librarian. All rights reserved.; Manufacturer_Part_Number: NX6008NBKR; RefDes: RefDes
Q5 = CMP-1259-00086-1: P-Channel Trench MOSFET, -50 V, -0.18 A, -55 to 150 degC, 3-Pin SOT23, Tape and Reel; Manufacturer: NXP Semiconductors; Automotive Qualified: Y; Packing: Tape & Reel; Channel Type: P; VGSth [typ] (V): -1.6; IDM [max] (A): -0.7; Code_JEDEC: TO-236AB; DatasheetVersion: Rev. 1; ID [max] (A): -0.18; Mounting Technology: Surface Mount; ComponentLink3URL: http://www.nxp.com/documents/outline_drawing/sot023_po.pdf; ComponentLink1Description: Manufacturer URL; PackageVersion: 06-03-16, 03/2006; ComponentLink2Description: Datasheet; PackageReference: SOT23; VDS [max] (V): -50; PackageDescription: 3-Pin Small Outline Transistor Package, Body 2.9 x 1.3 mm, Pitch 0.95 mm; ComponentLink2URL: http://www.nxp.com/documents/data_sheet/BSS84AK.pdf; ComponentLink3Description: Package Specification; ComponentLink1URL: http://www.nxp.com/; PartNumber: BSS84AK,215
Q6 = MMBT7002K: ki_keywords: Power MOSFET N-MOS Gate Protected; ki_description: Symbol for Gate Protected N-Channel MOSFET; Datasheet: https://diotec.com/de/produktliste/FET.html
R9 R10 R21 R22 = CMP-2000-04220-1: Manufacturer: Yageo; Part Number: RC0603FR-13470RL
R11-R13 R16-R19 R24-R28 R36 = CMP-2000-06989-2: as R1 on sheet AFE; Height: 0.022inch; Construction: Rectangular; Lead Free: Lead Free; Tolerance: 1%; Features: Automotive AEC-Q200; Packaging: Tape and Reel; Number of Terminations: 2; Mount: Surface Mount; Case Code (Imperial): 0603; Case/Package: 0603; Resistor Type: Thick Film; Radiation Hardening: No; Power Rating: 100mW; Max Operating Temperature: 155°C; Length: 1.55mm; Width: 0.031inch; Military Standard: Not; RoHS Compliant: Yes; Min Operating Temperature: -55°C; Series: RMCF; Depth: 0.8mm; Case Code (Metric): 1608; Contact Plating: Tin
R14 = CMP-03412-001424-1: RES SMD 127K OHM 1% 1/10W 0603; Manufacturer: Yageo; Voltage Rating: 75V; Power Rating: 0.1W; Temperature Coefficient: 50 ppm/°C; Tolerance: 0.01; Value: 127KΩ; Temperature Range High: +155°C; Mouser Description: Thin Film Resistors - SMD 1/10W 127K ohm 1% 50ppm; Package: RT0603; Ipc Land Pattern Name: RESC16080X45; Lead Free: Yes; Temperature: -55°C to +155°C; Digikey Description: RES SMD 127K OHM 1% 1/10W 0603; Device Class L3: Chip SMD Resistors; Temperature Range Low: -55°C; Height: 0.55mm; Device Class L1: Passive Components; ComponentLink2Description: Datasheet; Series: RT; RoHS: TRUE; Automotive: No; Footprint Url: http://www.yageo.com/exep/pages/download/literatures/PYu-R_Mount_10.pdf; ComponentLink2URL: http://www.yageo.com/documents/recent/PYu-RT_1-to-0.01_RoHS_L_9.pdf; Device Class L2: Resistors; Composition: Thin Film; Manufacturer Part Number: RT0603FRE07127KL; Category: Res; Octopart: https://octopart.com/rt0603fre07127kl-yageo-1402897
R15 R23 = CMP-2000-04285-1: Manufacturer: Yageo; Part Number: RC0603JR-07620RL
S1 S2 = TS02-66-70-BK-160-LCR-D: 6 x 6 mm, 7 mm Actuator Height, 160 gf, Black, Long Crimped, Through Hole, SPST, Tactile Switch; MF: CUI Devices; Check_prices: https://www.snapeda.com/parts/TS02-66-70-BK-160-LCR-D/CUI+Devices/view-part/?ref=eda; CUI_purchase_URL: https://www.cuidevices.com/product/switches/tactile-switches/ts02-series?utm_source=snapeda.com&utm_medium=referral&utm_campaign=snapedaBOM; Package: None; Price: None; Value: *; MP: TS02-66-70-BK-160-LCR-D; Purchase-URL: https://pricing.snapeda.com/search/part/TS02-66-70-BK-160-LCR-D/?ref=eda; Availability: In Stock; SnapEDA_Link: https://www.snapeda.com/parts/TS02-66-70-BK-160-LCR-D/CUI+Devices/view-part/?ref=snap
SW1 = CMP-1696-00002-1: Slide Switch, 500 V, -20 to 70 degC, 3-Pin THD, RoHS; Case\Package: SOT-23-5; Output Current: 150 mA; Nominal Output Voltage: 3.3 V; Max Power Dissipation: 250 mW; Min Input Voltage: 4.3 V; Outputs: 1; Max Input Voltage: 8 V; Dropout Voltage: 300 mV; PackageDescription: 3-Pin Through Hole Device, Body 11.6 x 4 mm, Pitch 2.5 mm; ComponentLink1URL: http://www.e-switch.ch/en/; RoHSCompliant: true; Length: 3 mm; ComponentLink1Description: Manufacturer URL; Power Rating: 250 mW; Mount: Surface Mount; Max Operating Temperature: 85 degC; REACH SVHC: No SVHC; Radiation Hardening: No; Height: 1.3 mm; Pins: 5; Max Ouput Current: 150 mA; Output Voltage: 3.3 V; Width: 1.8 mm; Package Quantity: 3000; ComponentLink2URL: https://www.e-switch.com/system/asset/product_line/data_sheet/119/EG.pdf; Min Operating Temperature: -40 degC; ComponentLink2Description: Datasheet; DatasheetVersion: Oct-15; PackageReference: EG1218; Packaging: Tape and Reel

## Nets that join several sheets
AGND: AFE (13 pins), EEG Inputs (28 pins)
AVDD: Power (C21.1 C24.1 U4.5), AFE (13 pins)
AVSS: Power (C5.1 C6.1 U3.5), AFE (19 pins)
BATT: Power (C30.1 U5.1), AFE (J5.5), Peripherals (9 pins)
DVDD: MCU (U1.9 U1.F4), Power (8 pins), AFE (9 pins), Peripherals (12 pins)
GND: MCU (9 pins), Power (15 pins), AFE (10 pins), Peripherals (42 pins)
AFE2CS: MCU (U1.Z3), AFE (J5.1)
AFE2MISO: MCU (U1.Z1), AFE (J5.3)
AFE2MOSI: MCU (U1.Z0), AFE (J5.4)
AFE2SCK: MCU (U1.Z2), AFE (J5.2)
AFECS: MCU (U1.A6), AFE (R32.2 U6.39)
AFEMISO: MCU (U1.E6), AFE (U6.43)
AFEMOSI: MCU (U1.11), AFE (U6.34)
AFERST: MCU (U1.B6), AFE (R33.2 U6.36)
AFESCK: MCU (U1.A3), AFE (U6.40)
BATLVL: MCU (U1.8), Peripherals (R14.1 R18.2)
BATMEASEN: MCU (U1.A4), Peripherals (Q6.1 R24.1)
BIASDRV: AFE (C18.2 R2.2), EEG Inputs (C25.5 R3.8)
BLUEN1: MCU (U1.5), Peripherals (Q1.1 R16.2)
BLUEN2: MCU (U1.13), Peripherals (Q7.1 R25.2)
BUZZEN: MCU (U1.1), Peripherals (Q4.1 R12.1)
D_N: MCU (U1.E5), Peripherals (J2.2)
D_P: MCU (U1.E4), Peripherals (J2.3)
DATAEN: MCU (U1.A5), Peripherals (D5.K R13.1 S1.3 S1.4)
DC: MCU (U1.Z5), Peripherals (J3.3)
DRDY: MCU (U1.B5), AFE (U6.47)
GRNEN1: MCU (U1.2), Peripherals (Q3.1 R17.2)
GRNEN2: MCU (U1.12), Peripherals (Q8.1 R26.2)
IN1N: AFE (U6.15), EEG Inputs (C29.5 R7.8)
IN1P: AFE (U6.16), EEG Inputs (C29.6 R7.7)
IN2N: AFE (U6.13), EEG Inputs (C28.7 R6.6)
IN2P: AFE (U6.14), EEG Inputs (C28.8 R6.5)
IN3N: AFE (U6.11), EEG Inputs (C28.5 R6.8)
IN3P: AFE (U6.12), EEG Inputs (C28.6 R6.7)
IN4N: AFE (U6.9), EEG Inputs (C27.7 R5.6)
IN4P: AFE (U6.10), EEG Inputs (C27.8 R5.5)
IN5N: AFE (U6.7), EEG Inputs (C27.5 R5.8)
IN5P: AFE (U6.8), EEG Inputs (C27.6 R5.7)
IN6N: AFE (U6.5), EEG Inputs (C26.7 R4.6)
IN6P: AFE (U6.6), EEG Inputs (C26.8 R4.5)
IN7N: AFE (U6.3), EEG Inputs (C26.5 R4.8)
IN7P: AFE (U6.4), EEG Inputs (C26.6 R4.7)
IN8N: AFE (U6.1), EEG Inputs (C25.7 R3.6)
IN8P: AFE (U6.2), EEG Inputs (C25.8 R3.5)
INSRB1: AFE (U6.17), EEG Inputs (C29.7 R7.6)
INSRB2: AFE (U6.18), EEG Inputs (C29.8 R7.5)
LCDCS: MCU (U1.B4), Peripherals (J3.5)
LCDMISO: MCU (U1.B2), Peripherals (J3.7)
LCDMOSI: MCU (U1.B3), Peripherals (J3.6)
LCDRST: MCU (U1.Z6), Peripherals (J3.4)
LCDSCK: MCU (U1.B1), Peripherals (J3.8)
LIT: MCU (U1.Z4), Peripherals (J3.1)
NRST: MCU (U1.14), Peripherals (P1.10 R36.1)
PWREN: Power (U5.3), Peripherals (D6.K SW1.2)
REDEN1: MCU (U1.6), Peripherals (Q2.1 R19.2)
REDEN2: MCU (U1.7), Peripherals (Q9.1 R27.2)
SWDCLK: MCU (U1.15), Peripherals (P1.4)
SWDIO: MCU (U1.16), Peripherals (P1.2)
TESTEN: MCU (U1.A2), Peripherals (D9.K R28.1 S2.3 S2.4)
UARTRX: MCU (U1.C1), Peripherals (P2.3)
UARTTX: MCU (U1.C2), Peripherals (P2.2)
VBUS: MCU (U1.F6), Peripherals (J2.1)